# EAGLE design GATEWY.PCB (EAGLE 7.5.0)
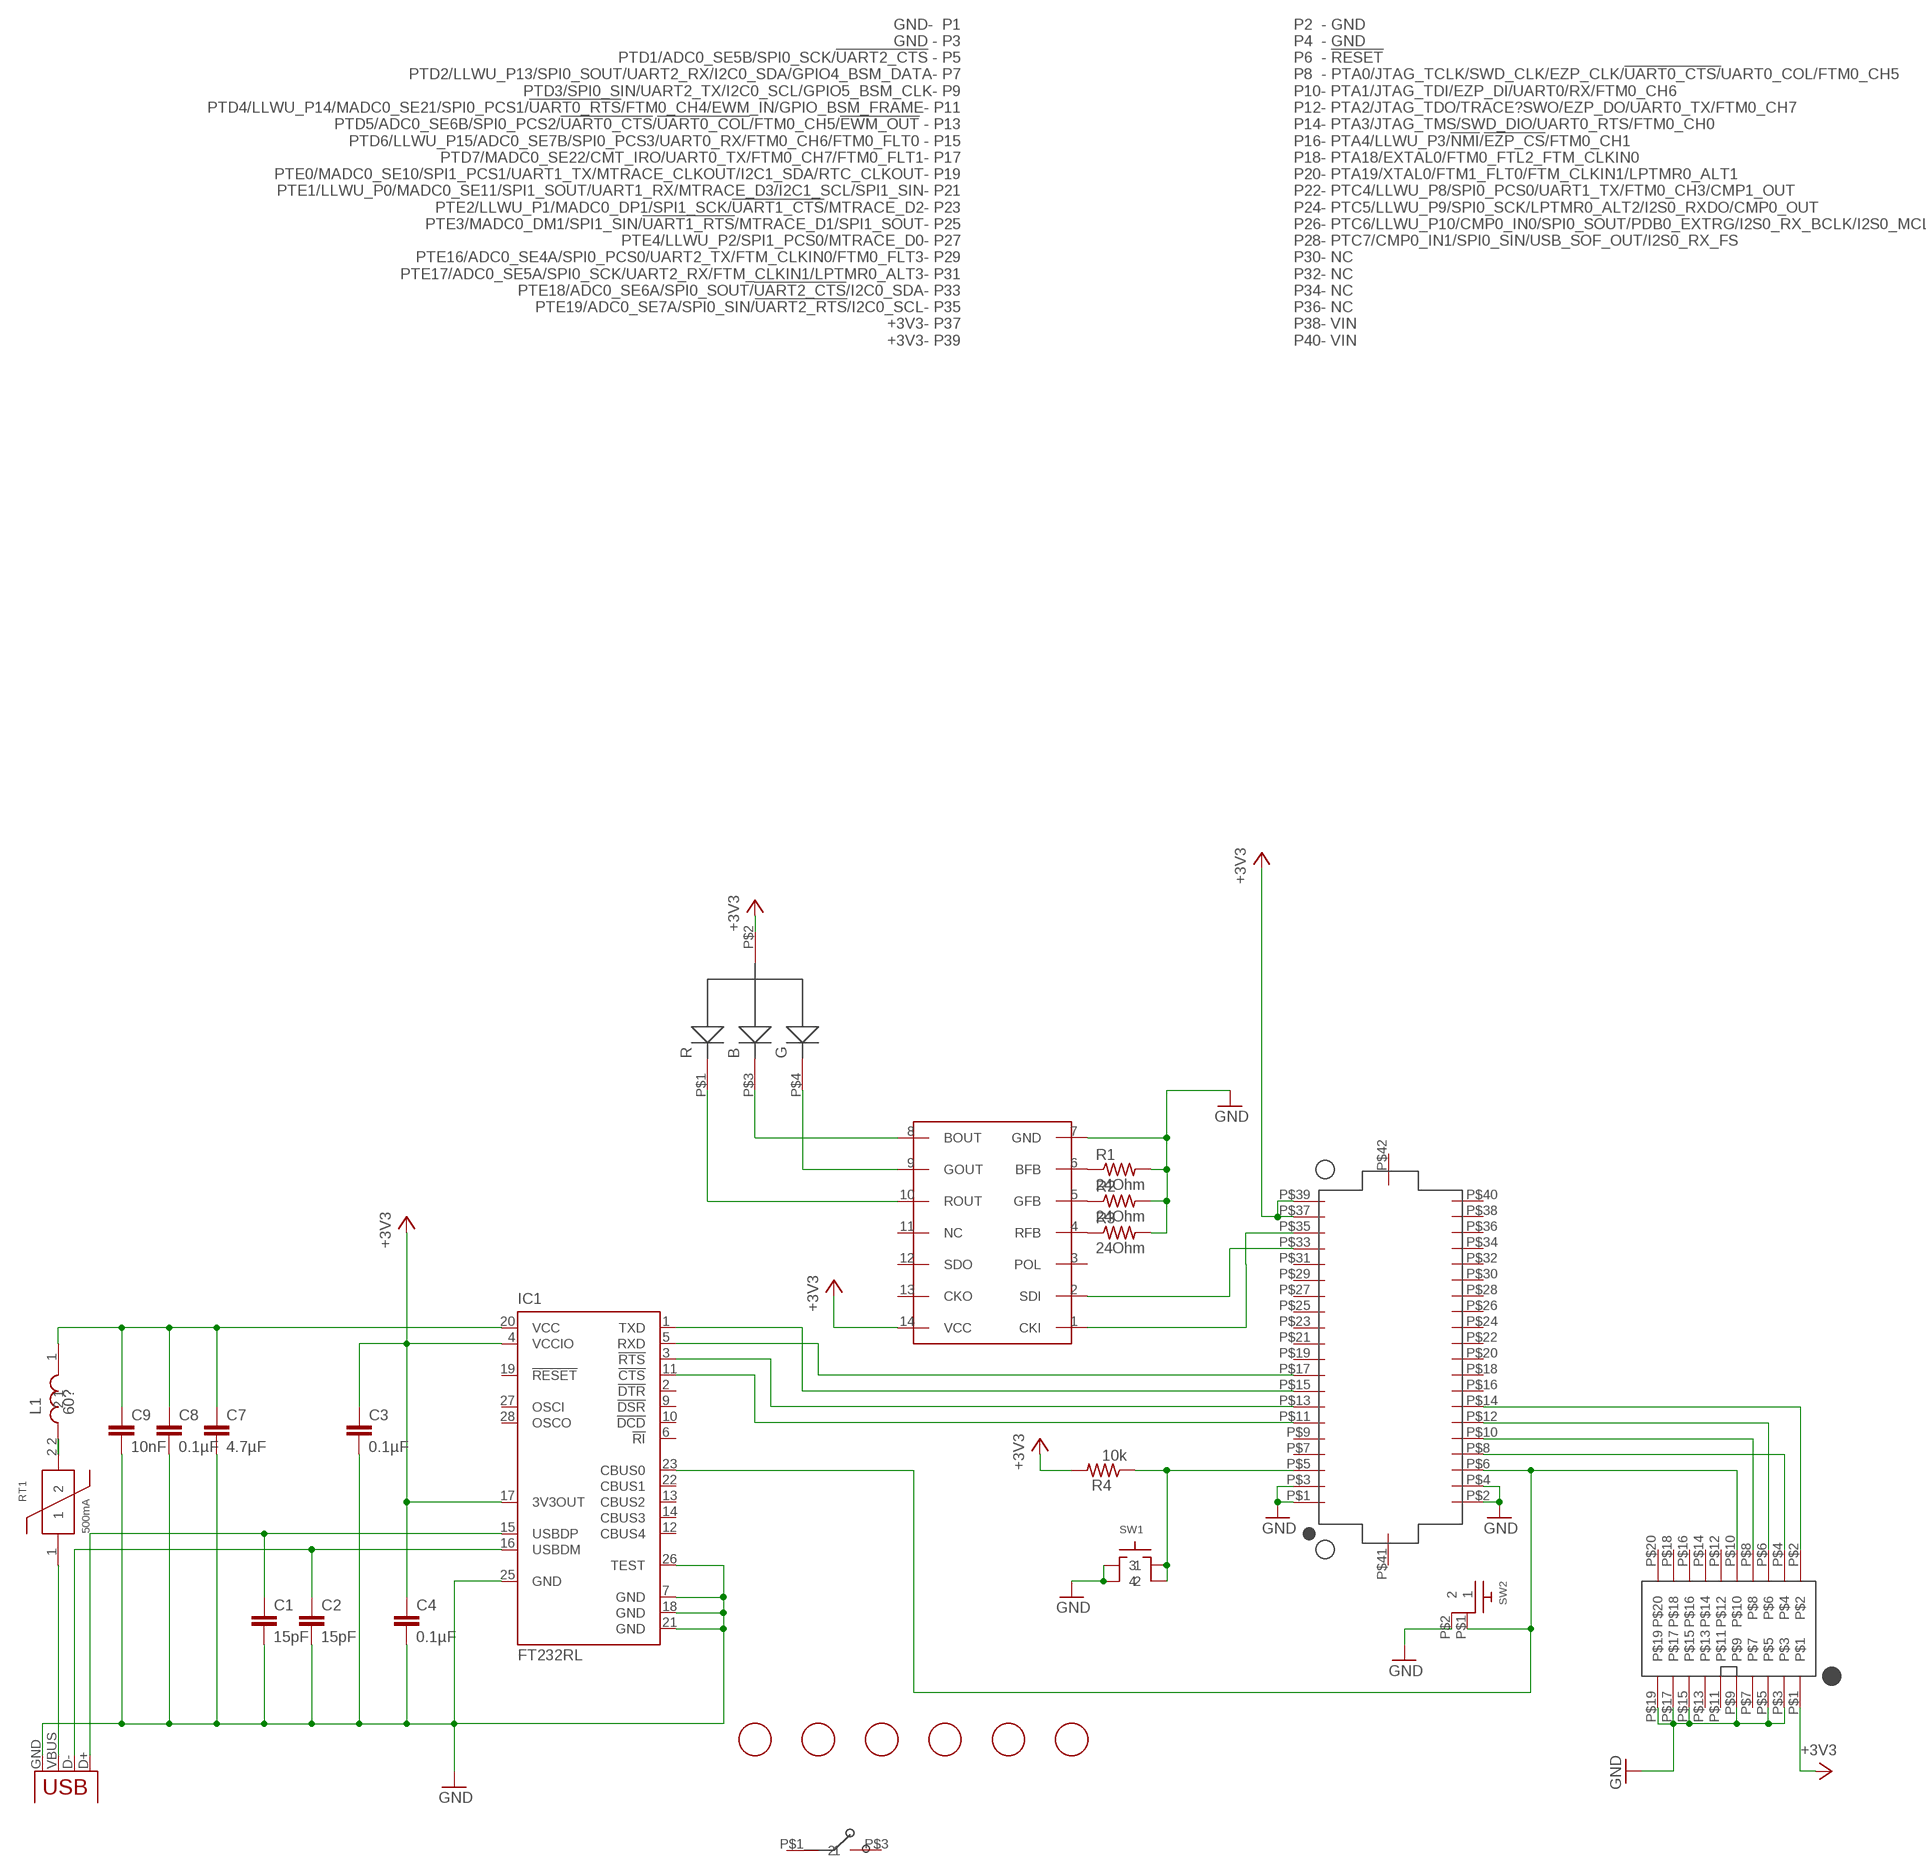
[diagram p0: schematic, sheet 1]

## Parts
AWESOME  CJS  [CJS]
C1  15pF  RF-C0402  [RF-C0402]
C2  15pF  RF-C0402  [RF-C0402]
C3  0.1µF  RF-C0402  [RF-C0402]
C4  0.1µF  RF-C0402  [RF-C0402]
C7  4.7µF  RF-C0805  [RF-C0805]
C8  0.1µF  RF-C0402  [RF-C0402]
C9  10nF  RF-C0402  [RF-C0402]
IC1  FT232RL  [SSOP28]
JTAG  2X10JTAGSMD  [2X10JTAG-SMD]
KW2  DF12_F  [DF12_F]
L1  60?  RF-L0603  [RF-L0603]
LED1  RGLBED  [RGBLED]
R1  24Ohm  RF-R0805  [RF-C0805]
R2  24Ohm  RF-R0805  [RF-C0805]
R3  24Ohm  RF-R0805  [RF-C0805]
R4  10k  RF-R0805  [RF-C0805]
RT1  500mA  SMD050F  [C1210]
SW1  SWITCH-TACTILE  [ESWITCH-TL3301PF]
SW2  RA_BUTTON  [RA_BUTTON]
U1  WS2801  [SO14]
U$14  FIDUCIAL  [FIDUCIAL_1MM]
U$18  FIDUCIAL  [FIDUCIAL_1MM]
U$25  FIDUCIAL  [FIDUCIAL_1MM]
U$26  FIDUCIAL  [FIDUCIAL_1MM]
U$27  FIDUCIAL  [FIDUCIAL_1MM]
U$28  FIDUCIAL  [FIDUCIAL_1MM]
X1  USBPTH  [USB-B-PTH]

## Nets
+3V3 [3V3]: C3.1 C4.1 IC1.4(VCCIO) IC1.17(3V3OUT) JTAG.P$1 KW2.P$37(+3V3) KW2.P$39(+3V3) LED1.P$2(ANODE) R4.2 U1.14(VCC)
CTS: IC1.3(!RTS) KW2.P$13(PTD5/ADC0_SE6B/SPI0_PCS2/!UART0_CTS!/!UART0_COL!/FTM0_CH5/!EWM_OUT)
GND [GNDA]: C1.2 C2.2 C3.2 C4.2 C7.2 C8.2 C9.2 IC1.7(GND) IC1.18(GND) IC1.21(GND) IC1.25(GND) IC1.26(TEST) JTAG.P$3 JTAG.P$5 JTAG.P$9 JTAG.P$15 JTAG.P$17 JTAG.P$19 KW2.P$1(GND) KW2.P$2(GND) KW2.P$3(GND) KW2.P$4(GND) R1.2 R2.2 R3.2 SW1.1 SW1.2 SW2.P$2 U1.7(GND) X1.GND
JTAG_CLK: JTAG.P$4 KW2.P$8(PTA0/JTAG_TCLK/SWD_CLK/EZP_CLK/!UART0_CTS/!UART0_COL/FTM0_CH5)
JTAG_TDI: JTAG.P$8 KW2.P$10(PTA1/JTAG_TDI/EZP_DI/UART0/RX/FTM0_CH6)
JTAG_TDO: JTAG.P$6 KW2.P$12(PTA2/JTAG_TDO/TRACE?SWO/EZP_DO/UART0_TX/FTM0_CH7)
JTAG_TMS: JTAG.P$2 KW2.P$14(PTA3/JTAG_TMS/SWD_DIO/UART0_RTS/FTM0_CH0)
N$4: LED1.P$4(GREEN) U1.9(GOUT)
N$5: LED1.P$3(BLUE) U1.8(BOUT)
N$7: LED1.P$1(RED) U1.10(ROUT)
N$10: KW2.P$33(PTE18/ADC0_SE6A/SPI0_SOUT/!UART2_CTS!/I2C0_SDA) U1.2(SDI)
N$11: R1.1 U1.6(BFB)
N$12: R2.1 U1.5(GFB)
N$13: R3.1 U1.4(RFB)
N$14: KW2.P$35(PTE19/ADC0_SE7A/SPI0_SIN/!UART2_RTS!/I2C0_SCL) U1.1(CKI)
N$17: KW2.P$5(PTD1/ADC0_SE5B/SPI0_SCK/!UART2_CTS) R4.1 SW1.3 SW1.4
RESET: IC1.23(CBUS0) JTAG.P$10 KW2.P$6(!RESET) SW2.P$1
RTS: IC1.11(!CTS) KW2.P$11(PTD4/LLWU_P14/MADC0_SE21/SPI0_PCS1/!UART0_RTS!/FTM0_CH4/EWM_IN/GPIO_BSM_FRAME)
RX: IC1.1(TXD) KW2.P$15(PTD6/LLWU_P15/ADC0_SE7B/SPI0_PCS3/UART0_RX/FTM0_CH6/FTM0_FLT0)
TX: IC1.5(RXD) KW2.P$17(PTD7/MADC0_SE22/CMT_IRO/UART0_TX/FTM0_CH7/FTM0_FLT1)
USB+: C1.1 IC1.15(USBDP) X1.D+
USB-: C2.1 IC1.16(USBDM) X1.D-
USB_VCC_1 [3V3]: RT1.1 X1.VBUS
USB_VCC_2 [3V3]: L1.2 RT1.2
USB_VCC_3 [3V3]: C7.1 C8.1 C9.1 IC1.20(VCC) L1.1
Unconnected: AWESOME.P$1 AWESOME.P$3 IC1.2(!DTR) IC1.6(!RI) IC1.9(!DSR) IC1.10(!DCD) IC1.12(CBUS4) IC1.13(CBUS2) IC1.14(CBUS3) IC1.19(!RESET) IC1.22(CBUS1) IC1.27(OSCI) IC1.28(OSCO) JTAG.P$7 JTAG.P$11 JTAG.P$12 JTAG.P$13 JTAG.P$14 JTAG.P$16 JTAG.P$18 JTAG.P$20 KW2.P$7(PTD2/LLWU_P13/SPI0_SOUT/UART2_RX/I2C0_SDA/GPIO4_BSM_DATA) KW2.P$9(PTD3/SPI0_SIN/UART2_TX/I2C0_SCL/GPIO5_BSM_CLK) KW2.P$16(PTA4/LLWU_P3/!NMI!/!EZP_CS!/FTM0_CH1) KW2.P$18(PTA18/EXTAL0/FTM0_FTL2_FTM_CLKIN0) KW2.P$19(PTE0/MADC0_SE10/SPI1_PCS1/UART1_TX/MTRACE_CLKOUT/I2C1_SDA/RTC_CLKOUT) KW2.P$20(PTA19/XTAL0/FTM1_FLT0/FTM_CLKIN1/LPTMR0_ALT1) KW2.P$21(PTE1/LLWU_P0/MADC0_SE11/SPI1_SOUT/UART1_RX/MTRACE_D3/I2C1_SCL/SPI1_SIN) KW2.P$22(PTC4/LLWU_P8/SPI0_PCS0/UART1_TX/FTM0_CH3/CMP1_OUT) KW2.P$23(PTE2/LLWU_P1/MADC0_DP1/SPI1_SCK/!UART1_CTS!/MTRACE_D2) KW2.P$24(PTC5/LLWU_P8/SPI0_PCS0/UART1_TX/FTM0_CH3/CMP1_OUT) KW2.P$25(PTE3/MADC0_DM1/SPI1_SIN/!UART1_RTS!/MTRACE_D1/SPI1_SOUT) KW2.P$26(PTC6/LLWU_P10/CMP0_IN0/SPI0_SOUT/PDB0_EXTRG/I2S0_RX_BCLK/I2S0_MCLK) KW2.P$27(PTE4/LLWU_P2/SPI1_PCS0/MTRACE_D0) KW2.P$28(PTC7/CMP0_IN1/SPI0_SIN/USB_SOF_OUT/I2S0_RX_FS) KW2.P$29(PTE16/ADC0_SE4A/SPI0_PCS0/UART2_TX/FTM_CLKIN0/FTM0_FLT3) KW2.P$30(NC) KW2.P$31(PTE17/ADC0_SE5A/SPI0_SCK/UART2_RX/FTM_CLKIN1/LPTMR0_ALT3) KW2.P$32(NC) KW2.P$34(NC) KW2.P$36(NC) KW2.P$38(VIN) KW2.P$40(VIN) KW2.P$41 KW2.P$42 U1.3(POL) U1.11(NC) U1.12(SDO) U1.13(CKO)

## Library data of the parts
AWESOME = KW2:CJS; MFGN: Copal Electronics Inc; MFGP: CJS-1200TA
C1 C2 = GW-devices:RF-C: RF capacitor pads for FSL reference design; MFGN: Murata; MFGP: GRM1555C1H150JZ01
C3 C4 C8 = GW-devices:RF-C: RF capacitor pads for FSL reference design; MFGN: Murata; MFGP: GRM155R61A104KA01D
C7 = GW-devices:RF-C: RF capacitor pads for FSL reference design; MFGN: Murata; MFGP: GRM219R61A475KE19D
C9 = GW-devices:RF-C: RF capacitor pads for FSL reference design; MFGN: Murata; MFGP: GRM155R71E103KA01D
IC1 = ftdichip:FT232R: Source: http://www.ftdichip.com/Documents/DataSheets/DS_FT232R_v104.pdf; MFGN: FTDI; MFGP: FT232RL
JTAG = KW2:2X10JTAG; MFGN: Sullins; MFGP: GRPB102VWQS-RC
KW2 = KW2:DF12_F; MFGN: Hirose; MFGP: DF12(3.0)-40DP-0.5V(86)
L1 = GW-devices:RF-L: RF inductor pads for FSL reference design; MFGN: Murata; MFGP: BLM18PG600SN1D
LED1 = KW2:RGLBED; MFGN: Cree; MFGP: CLV1A-FKB-CK1N1G1BB7R4S3
R1-R3 = GW-devices:RF-R: RF resistor pads for FSL reference design; MFGN: Vishay Dale; MFGP: CRCW080524R0FKEA
R4 = GW-devices:RF-R: RF resistor pads for FSL reference design; MFGN: Vishay Dale; MFGP: CRCW080510K0FKEA
RT1 = GW-devices:SMD050F: Tyco current limit switch; MFGN: Tyco; MFGP: MICROSMD050F-2
SW1 = GW-devices:SWITCH-TACTILE; MFGN: E-Switch; MFGP: TL3301PF160QG
SW2 = KW2:RA_BUTTON; MFGN: TE Connectivity; MFGP: 2-1825027-0
U1 = GW-devices:WS2801; MFGN: WorldSemi; MFGP: WS2801
U$14 U$18 U$25-U$28 = adafruit:FIDUCIAL: For use by pick and place machines to calibrate the vision/machine, 1mm By microbuilder.eu; NOTES: DNP
X1 = SparkFun:USB: USB Connectors USB-B-PTH is fully proven SKU : PRT-00139 USB-miniB is fully proven SKU : PRT-00587 USB-A-PCB is untested. USB-A-H is throughly reviewed, but untested. Spark Fun Electronics SKU : PRT-00437 USB-B-SMT is throughly reviewed, but untested. Needs silkscreen touching up. USB-A-S has not been used/tested USB-MB-H has not been used/tested; MFGN: Tyco; MFGP: 292304-1

## Net classes
1 3V3: width 0.4 mm, drill 0.4 mm, clearance 0.1 mm
2 GND: width 0.4 mm, drill 0.4 mm, clearance 0.1 mm
3 POWER: width 0.4 mm, drill 0.4 mm, clearance 0.1 mm
4 GNDA: width 0.4 mm, drill 0.4 mm, clearance 0.1 mm

## Board
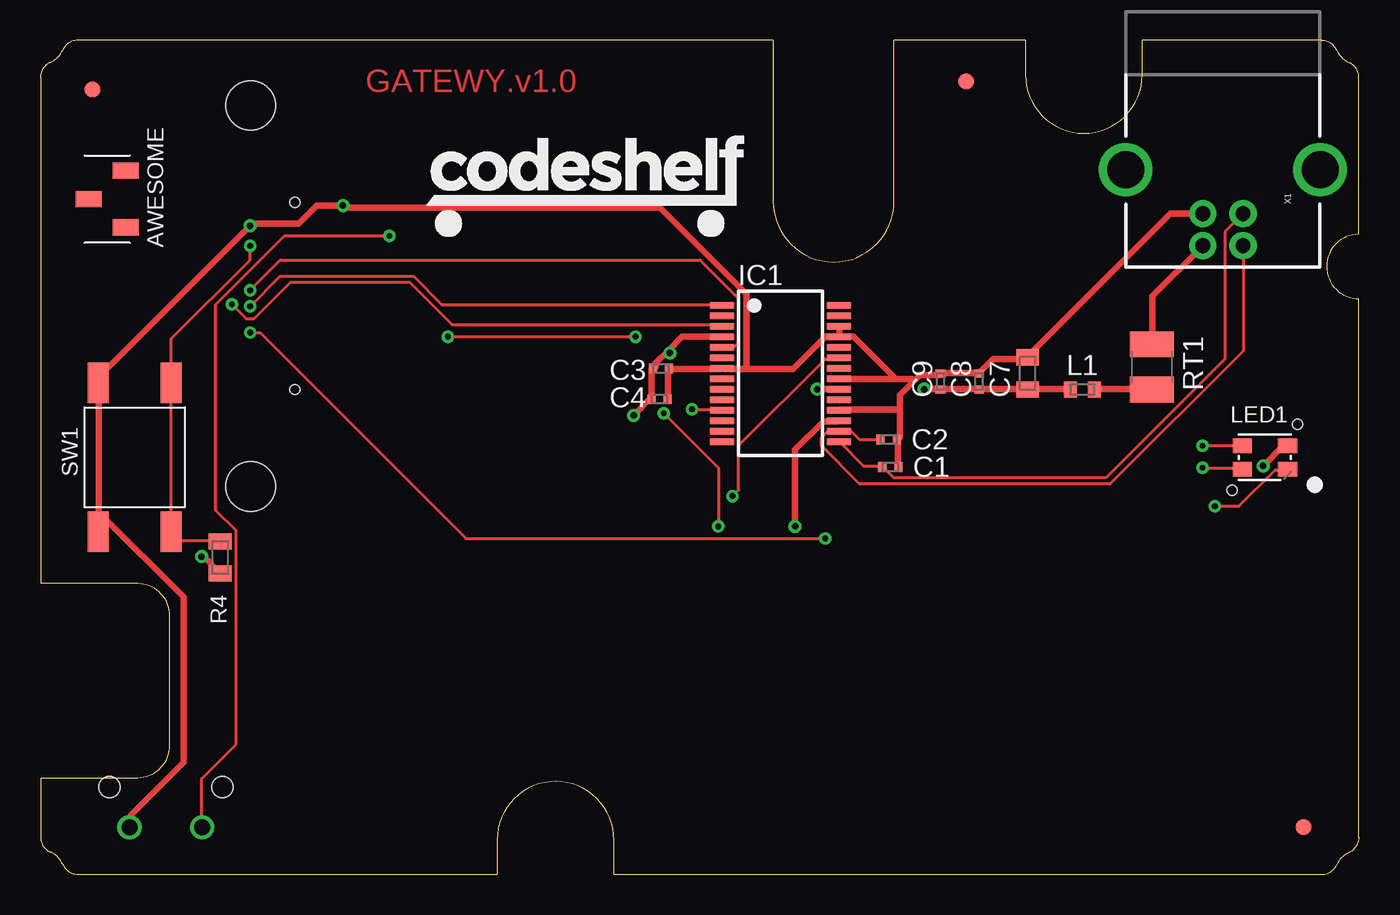
[diagram p1: board, top side]
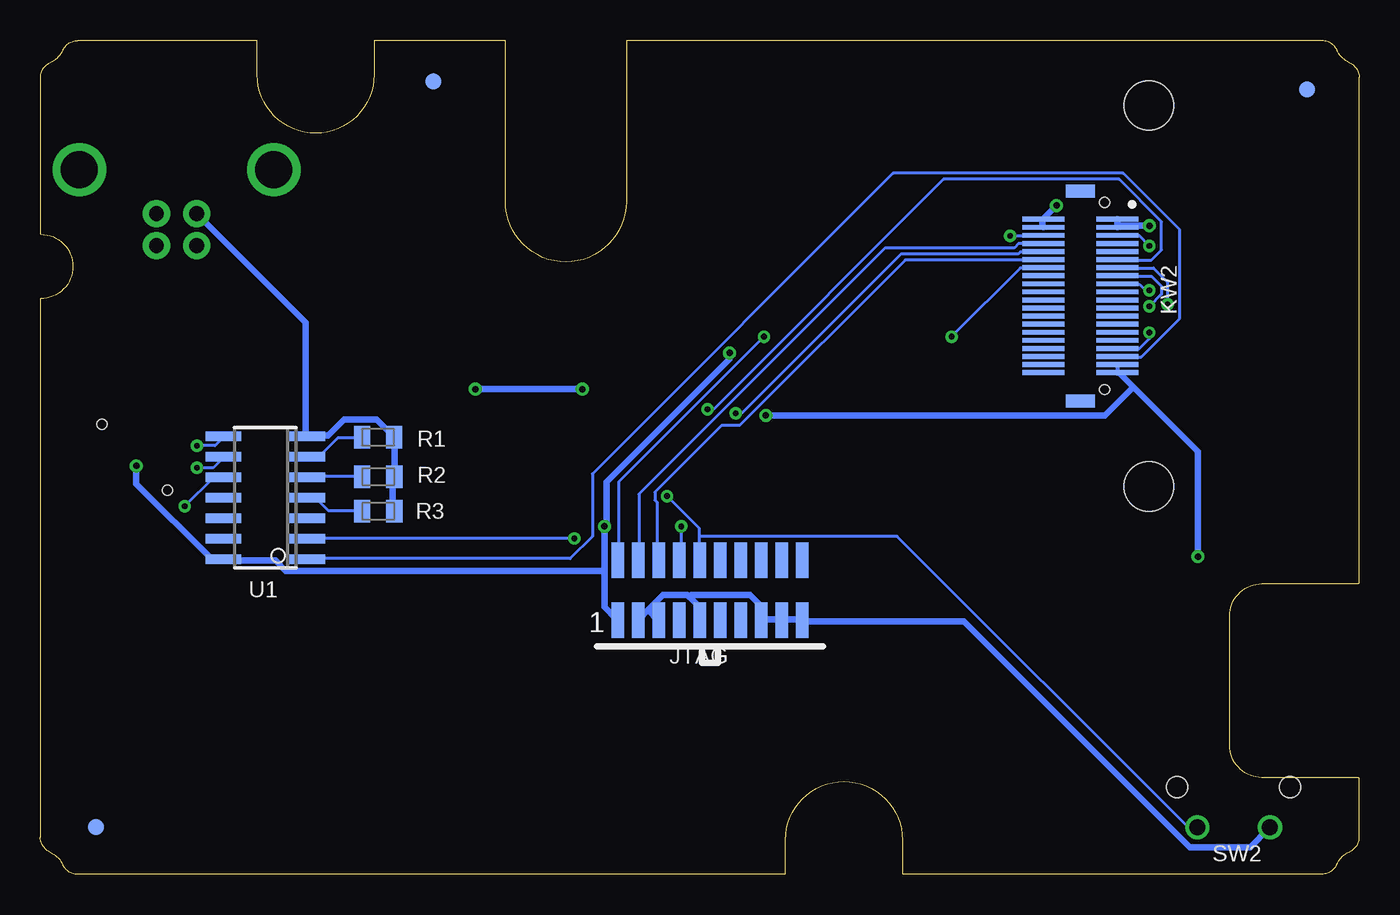
[diagram p2: board, bottom side, seen from below]

Size 81.68 x 51.66 mm. Coordinates in mm from the lower left corner, seen from the top.
Outline: 81.66,2.29 81.66,35.66 arc-180 81.66,39.65 81.66,49.38 arc66 81.07,50.28
Outline: 2.31,0 28.29,0 28.29,2.13 arc-180 35.53,2.13 35.53,0 79.37,0 arc67 80.29,0.61
Outline: 79.37,51.66 68.25,51.66 68.25,49.53 arc-180 61.01,49.53 61.01,51.66 52.88,51.66 52.88,41.68 arc-180 45.39,41.68 45.39,51.66 2.31,51.66 arc67 1.39,51.06
Outline: 0.02,49.38 0.02,18.01 6.02,18.01 arc-90 8.02,16 8.02,8 arc-90 6.02,5.99 0.02,5.99 0.02,2.29 arc66 0.61,1.38
Outline: 81.68,2.29 arc-66 81.07,1.37 arc43 80.3,0.6
Outline: 2.31,0.01 arc-67 1.39,0.61 arc43 0.61,1.39
Outline: 0,49.38 arc-66 0.61,50.29 arc43 1.38,51.06
Outline: 79.37,51.66 arc-67 80.29,51.05 arc43 81.07,50.28
Copper layers (1*16): Top 0.0356mm / dielectric 1.5011mm / Bottom 0.0356mm
Design rules "Codeshelf_Standard": minimum track width 7mil, minimum drill 14mil, track to track 7mil, track to pad 7mil, pad to pad 7mil, via to via 7mil, smd to smd 0mil, copper to edge 20mil, drill to drill 8mil, minimum pad ring 10mil, minimum via ring 8mil, stop-mask expansion 4mil, vias tented up to drill 0mil, thermal gap 10mil

### Footprints (pad centres in the part's own frame; a part is rotated, then mirrored left to right if it is on the bottom)
CJS = smd 1 x 1.6: P$1 0,1.15; P$2 -1.75,-1.15; P$3 1.75,-1.15
RF-C0402 = smd 0.5 x 0.6: 1 -0.5,0; 2 0.5,0
RF-C0805 = smd 1 x 1.4: 1 -1,0; 2 1,0
SSOP28 = smd 0.4 x 1.5: 1 -4.225,-3.625; 2 -3.575,-3.625; 3 -2.925,-3.625; 4 -2.275,-3.625; 5 -1.625,-3.625; 6 -0.975,-3.625; 7 -0.325,-3.625; 8 0.325,-3.625; 9 0.975,-3.625; 10 1.625,-3.625; 11 2.275,-3.625; 12 2.925,-3.625; 13 3.575,-3.625; 14 4.225,-3.625; 15 4.225,3.625; 16 3.575,3.625; 17 2.925,3.625; 18 2.275,3.625; 19 1.625,3.625; 20 0.975,3.625; 21 0.325,3.625; 22 -0.325,3.625; 23 -0.975,3.625; 24 -1.625,3.625; 25 -2.275,3.625; 26 -2.925,3.625; 27 -3.575,3.625; 28 -4.225,3.625
2X10JTAG-SMD = smd 0.76 x 2.2: P$1 -5.715,-1.85; P$2 -5.715,1.85; P$3 -4.445,-1.85; P$4 -4.445,1.85; P$5 -3.175,-1.85; P$6 -3.175,1.85; P$7 -1.905,-1.85; P$8 -1.905,1.85; P$9 -0.635,-1.85; P$10 -0.635,1.85; P$11 0.635,-1.85; P$12 0.635,1.85; P$13 1.905,-1.85; P$14 1.905,1.85; P$15 3.175,-1.85; P$16 3.175,1.85; P$17 4.445,-1.85; P$18 4.445,1.85; P$19 5.715,-1.85; P$20 5.715,1.85
DF12_F = smd 0.3 x 2.6: P$1 -4.75,2.3; P$2 -4.75,-2.3; P$3 -4.25,2.3; P$4 -4.25,-2.3; P$5 -3.75,2.3; P$6 -3.75,-2.3; P$7 -3.25,2.3; P$8 -3.25,-2.3; P$9 -2.75,2.3; P$10 -2.75,-2.3; P$11 -2.25,2.3; P$12 -2.25,-2.3; P$13 -1.75,2.3; P$14 -1.75,-2.3; P$15 -1.25,2.3; P$16 -1.25,-2.3; P$17 -0.75,2.3; P$18 -0.75,-2.3; P$19 -0.25,2.3; P$20 -0.25,-2.3; P$21 0.25,2.3; P$22 0.25,-2.3; P$23 0.75,2.3; P$24 0.75,-2.3; P$25 1.25,2.3; P$26 1.25,-2.3; P$27 1.75,2.3; P$28 1.75,-2.3; P$29 2.25,2.3; P$30 2.25,-2.3; P$31 2.75,2.3; P$32 2.75,-2.3; P$33 3.25,2.3; P$34 3.25,-2.3; P$35 3.75,2.3; P$36 3.75,-2.3; P$37 4.25,2.3; P$38 4.25,-2.3; P$39 4.75,2.3; P$40 4.75,-2.3 | smd 0.8 x 1.8: P$41 -6.5,0; P$42 6.5,0 | hole 0.6: -5.8,1.5; 5.8,1.5 | hole 3.048: -11.8,4.24; 11.8,4.24
RF-L0603 = smd 0.8 x 1: 1 -0.75,0; 2 0.75,0
RGBLED = smd 1.2 x 0.9: P$1 1.4,-0.725; P$2 1.4,0.725; P$3 -1.4,0.725; P$4 -1.4,-0.725 | hole 0.61: 2.019,2.045; -2.019,-2.045
C1210 = smd 1.6 x 2.7: 1 -1.4,0; 2 1.4,0
ESWITCH-TL3301PF = smd 2.5 x 1.3: 1 -4.61,2.25; 2 4.61,2.25; 3 -4.61,-2.25; 4 4.61,-2.25
RA_BUTTON = drill 0.99: P$1 -2.25,0; P$2 2.25,0 | hole 1.3: -3.501,2.49; 3.501,2.49
SO14 = smd 0.6 x 2.2: 1 -3.81,-2.6; 2 -2.54,-2.6; 3 -1.27,-2.6; 4 0,-2.6; 5 1.27,-2.6; 6 2.54,-2.6; 7 3.81,-2.6; 8 3.81,2.6; 9 2.54,2.6; 10 1.27,2.6; 11 0,2.6; 12 -1.27,2.6; 13 -2.54,2.6; 14 -3.81,2.6
FIDUCIAL_1MM = smd 1 x 1: 1 0,0
USB-B-PTH = drill 0.914 pad 1.676: D+ 0,1.25; D- 1.981,1.25; GND 0,-1.25; VBUS 1.981,-1.25 | drill 2.286: P$1 -2.718,-6.02; P$2 -2.718,6.02

### Placement (x,y rotation side)
AWESOME  4.14,41.83 90 top
C1  52.64,25.23 0 top
C2  52.54,26.93 0 top
C3  38.44,31.33 0 top
C4  38.34,29.43 0 top
C7  61.14,31.03 90 top
C8  58.14,30.53 90 top
C9  55.74,30.53 90 top
IC1  45.84,31.03 270 top
JTAG  40.2,17.61 0 bottom
KW2  17.27,35.83 270 bottom
L1  64.54,30.03 0 top
LED1  75.84,25.83 0 top
R1  60.76,27.07 0 bottom
R2  60.75,24.63 0 bottom
R3  60.75,22.49 0 bottom
R4  11.14,19.63 270 top
RT1  68.84,31.43 270 top
SW1  5.84,25.83 90 top
SW2  7.77,2.92 0 bottom
U1  67.75,23.33 90 bottom
U$14  78.24,2.93 0 top
U$18  3.24,48.63 0 top
U$25  57.34,49.13 0 top
U$26  57.34,49.13 0 bottom
U$27  3.24,48.63 0 bottom
U$28  78.24,2.93 0 bottom
X1  73.24,40.93 270 top

### Tracks (layer width: path | path; a pad name or v marks a point on that pad's centre or on a via)
+3V3  (via drill 0.4)
  Top 0.4: v9.99,19.68 10.11,19.68 11.11,18.68 R4.2 | LED1.P$2 76.99,26.56 v75.74,25.31 | 38.86,32.43 39.74,33.31 42.11,33.31 IC1.4 | 38.86,32.43 38.11,31.68 38.11,31.43 C3.1 37.86,31.31 37.86,29.43 C4.1 37.74,29.43 v36.74,28.43 | v46.74,21.56 46.74,26.31 48.49,28.06 49.36,28.06 IC1.17 | v38.99,32.31 38.86,32.43
  Bottom 0.254: KW2.P$37 KW2.P$39
  Bottom 0.4: v9.99,19.68 9.99,26.18 13.99,30.18 | 13.99,30.18 14.86,31.06 KW2.P$39 | v75.74,25.31 75.74,24.18 71.11,19.56 70.36,19.56 U1.14 70.24,19.43 67.11,19.43 66.49,18.81 46.86,18.81 46.74,18.81 | 46.74,18.81 46.74,16.56 45.99,15.81 JTAG.P$1 | 46.74,18.81 v46.74,21.56 46.61,21.68 46.61,24.31 38.99,31.93 v38.99,32.31 | v36.74,28.43 15.74,28.43 14.11,30.06 13.99,30.18
CTS  (via drill 0.36)
  Top 0.178: v11.86,35.31 12.74,34.43 13.24,34.43 15.49,36.68 22.86,36.68 25.49,34.06 42.11,34.06 IC1.3
  Bottom 0.178: v11.86,35.31 11.86,36.68 12.74,37.56 14.86,37.56 KW2.P$13
GND  (via drill 0.4)
  Top 0.4: C4.2 38.86,29.43 38.86,31.31 C3.2 39.11,31.31 42.11,31.31 IC1.7 42.36,31.31 43.74,31.31 | IC1.25 49.49,33.31 49.49,33.93 IC1.26 | C1.2 53.11,25.31 53.11,26.93 C2.2 53.24,27.06 53.24,28.81 | 53.24,28.81 53.24,29.68 54.11,30.56 | 54.11,30.56 54.49,30.93 55.61,30.93 C9.2 55.74,31.06 58.11,31.06 C8.2 58.24,31.18 58.99,31.93 61.11,31.93 C7.2 61.24,32.18 69.99,40.93 X1.GND | IC1.18 49.49,28.81 53.11,28.81 53.24,28.81 | 52.86,30.68 53.99,30.68 54.11,30.56 | 52.86,30.68 49.49,30.68 IC1.21 | IC1.25 49.61,33.31 50.36,33.31 52.86,30.81 52.86,30.68 | 43.74,31.31 46.61,31.31 48.61,33.31 49.36,33.31 IC1.25 | SW2.P$2 5.61,2.93 5.61,3.68 8.86,6.93 8.86,17.18 3.74,22.31 SW1.1 3.61,21.31 3.61,30.43 SW1.2 3.74,30.56 3.74,30.93 v12.99,40.18 13.11,40.31 15.99,40.31 17.11,41.43 v18.74,41.43 18.86,41.31 38.36,41.31 43.74,35.93 43.74,31.43 43.74,31.31
  Bottom 0.4: R3.2 59.86,22.56 59.86,24.56 R2.2 59.74,24.81 59.74,27.06 R1.2 59.86,27.18 60.86,28.18 62.86,28.18 63.86,27.18 65.11,27.18 U1.7 65.24,27.31 65.24,34.18 X1.GND | 41.49,17.18 41.61,17.31 43.11,17.31 44.05,16.37 | 41.49,17.18 40.86,16.56 40.86,15.81 JTAG.P$9 | 44.05,16.37 44.61,15.81 JTAG.P$3 | JTAG.P$5 43.49,15.81 43.99,16.31 44.05,16.37 | 41.49,17.18 41.36,17.31 37.74,17.31 37.11,16.68 37.11,15.93 JTAG.P$15 36.99,15.81 35.86,15.81 JTAG.P$17 35.74,15.81 34.49,15.81 JTAG.P$19 34.36,15.68 24.49,15.68 10.49,1.68 6.74,1.68 5.61,2.81 SW2.P$2 | KW2.P$4 19.61,40.18 19.61,40.56 KW2.P$2 19.49,40.68 v18.74,41.43 | KW2.P$1 14.99,40.56 14.99,40.18 KW2.P$3 14.86,40.18 v12.99,40.18
JTAG_CLK
  Bottom 0.178: JTAG.P$4 44.61,19.56 44.61,23.56 29.36,38.81 21.36,38.81 21.11,39.06 19.61,39.06 KW2.P$8
JTAG_TDI  (via drill 0.36)
  Top 0.178: v41.99,21.56 41.99,25.18 v38.61,28.56
  Bottom 0.178: v41.99,21.56 41.99,19.56 JTAG.P$8 | v38.61,28.56 38.24,28.56 28.36,38.43 21.11,38.43 20.99,38.56 19.61,38.56 KW2.P$10
JTAG_TDO
  Bottom 0.178: JTAG.P$6 43.49,19.56 43.49,23.06 43.61,23.18 43.61,23.68 39.49,27.81 38.36,27.81 28.11,38.06 19.61,38.06 KW2.P$12
JTAG_TMS  (via drill 0.36)
  Top 0.178: v25.24,33.31 v36.86,33.31
  Bottom 0.178: v36.86,33.31 45.86,24.31 45.86,19.56 JTAG.P$2 | v25.24,33.31 20.99,37.56 19.61,37.56 KW2.P$14
N$4  (via drill 0.36)
  Top 0.178: v71.99,25.18 74.36,25.18 LED1.P$4
  Bottom 0.178: v71.99,25.18 70.99,25.18 70.36,25.81 U1.9
N$5  (via drill 0.36)
  Top 0.178: v71.99,26.56 74.36,26.56 LED1.P$3
  Bottom 0.178: v71.99,26.56 70.86,26.56 70.36,27.06 U1.8
N$7  (via drill 0.36)
  Top 0.178: v72.74,22.81 74.24,22.81 76.49,25.06 77.24,25.06 LED1.P$1
  Bottom 0.178: v72.74,22.81 70.99,24.56 70.36,24.56 U1.10
N$10  (via drill 0.36)
  Top 0.178: v48.61,20.81 26.36,20.81 13.61,33.56 v12.99,33.56
  Bottom 0.178: v48.61,20.81 65.11,20.81 U1.2 | v12.99,33.56 12.99,33.18 13.61,32.56 14.86,32.56 KW2.P$33
N$11
  Bottom 0.178: R1.1 61.86,27.06 63.24,27.06 64.36,25.93 65.11,25.93 U1.6
N$12
  Bottom 0.178: R2.1 61.86,24.68 65.11,24.68 U1.5
N$13
  Bottom 0.178: R3.1 61.86,22.56 63.86,22.56 64.61,23.31 65.11,23.31 U1.4
N$14
  Bottom 0.178: U1.1 65.11,19.56 48.86,19.56 47.49,20.93 47.49,24.81 28.86,43.43 14.61,43.43 11.11,39.93 11.11,34.43 13.49,32.06 14.86,32.06 KW2.P$35
N$17  (via drill 0.36)
  Top 0.178: R4.1 11.11,20.68 8.61,20.68 8.11,21.18 SW1.3 8.11,21.31 8.11,30.43 SW1.4 8.11,30.56 8.11,33.18 12.99,38.06 v12.99,38.93
  Bottom 0.178: v12.99,38.93 13.61,39.56 14.86,39.56 KW2.P$5
RESET  (via drill 0.36)
  Top 0.178: v42.86,23.43 43.24,23.81 43.24,26.56 48.61,31.93 49.36,31.93 IC1.23 | v21.61,39.56 15.11,39.56 10.86,35.31 10.86,22.56 12.11,21.31 12.11,8.06 9.99,5.93 9.99,2.93 SW2.P$1
  Bottom 0.178: v42.86,23.43 40.86,21.43 40.86,20.93 | 40.86,20.93 40.86,19.56 JTAG.P$10 | v21.61,39.56 19.61,39.56 KW2.P$6 | 40.86,20.93 28.61,20.93 10.61,2.93 10.11,2.93 SW2.P$1
RTS  (via drill 0.36)
  Top 0.178: v40.36,28.81 42.11,28.81 IC1.11
  Bottom 0.178: v40.36,28.81 39.99,28.81 25.74,43.06 14.86,43.06 12.24,40.43 12.24,38.68 12.86,38.06 14.86,38.06 KW2.P$11
RX  (via drill 0.36)
  Top 0.178: v12.99,35.18 14.86,37.06 23.11,37.06 24.86,35.31 42.11,35.31 IC1.1
  Bottom 0.178: v12.99,35.18 12.24,35.93 12.24,36.43 12.86,37.06 14.86,37.06 KW2.P$15
TX  (via drill 0.36)
  Top 0.178: v12.99,36.18 14.86,38.06 40.86,38.06 43.24,35.68 43.24,32.93 42.99,32.68 42.24,32.68 IC1.5
  Bottom 0.178: v12.99,36.18 13.24,36.18 13.61,36.56 14.86,36.56 KW2.P$17
USB+
  Top 0.178: IC1.15 49.49,26.81 50.99,25.31 52.11,25.31 C1.1 52.24,25.18 52.86,24.56 65.99,24.56 73.36,31.93 73.36,39.81 X1.D+
USB-
  Top 0.178: C2.1 51.99,26.93 50.74,26.93 50.24,27.43 49.49,27.43 IC1.16 49.36,27.43 48.74,27.43 48.36,27.06 48.36,26.56 50.74,24.18 66.24,24.18 74.49,32.43 74.49,38.93 X1.D-
USB_VCC_1
  Top 0.4: RT1.1 68.86,32.93 68.86,35.81 71.99,38.93 X1.VBUS
USB_VCC_2
  Top 0.4: L1.2 65.36,30.06 68.74,30.06 RT1.2
USB_VCC_3  (via drill 0.4)
  Top 0.4: L1.1 63.74,30.06 61.24,30.06 C7.1 60.99,30.06 58.24,30.06 C8.1 58.11,30.06 55.74,30.06 C9.1 55.61,30.06 v54.74,30.06 | v48.11,30.06 49.36,30.06 IC1.20
  Bottom 0.4: v54.74,30.06 v48.11,30.06

### Text on the board
Top: GATEWY.v1.0